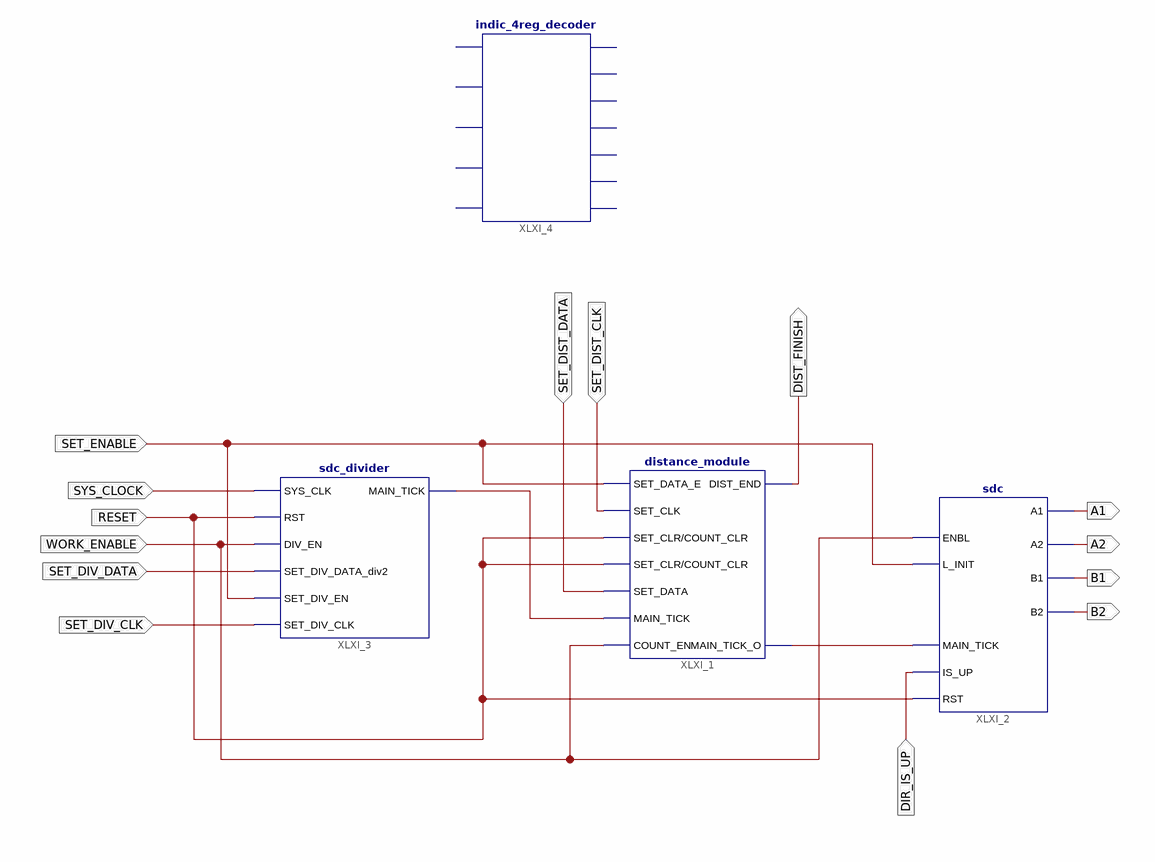
[diagram p0: schematic sheet 1]
// Xilinx ISE schematic topboard.sch (spartan6) as structural Verilog: 4 symbols, 14 ports
module topboard (
  input  RESET,
  input  WORK_ENABLE,
  input  SET_ENABLE,
  input  SET_DIV_DATA,
  input  SET_DIV_CLK,
  input  SYS_CLOCK,
  input  SET_DIST_CLK,
  input  SET_DIST_DATA,
  input  DIR_IS_UP,
  output A1,
  output A2,
  output B1,
  output B2,
  output DIST_FINISH
);

  wire XLXN_1, XLXN_2;

  sdc XLXI_2 (
    .ENBL(WORK_ENABLE), .L_INIT(SET_ENABLE), .A1(A1), .A2(A2), .B1(B1), .B2(B2), .MAIN_TICK(XLXN_1),
    .IS_UP(DIR_IS_UP), .RST(RESET));
  distance_module XLXI_1 (
    .SET_DATA_E(SET_ENABLE), .SET_CLK(SET_DIST_CLK), .SET_CLR(RESET), .COUNT_CLR(RESET),
    .SET_DATA(SET_DIST_DATA), .MAIN_TICK(XLXN_2), .COUNT_EN(WORK_ENABLE), .DIST_END(DIST_FINISH),
    .MAIN_TICK_O(XLXN_1));
  sdc_divider XLXI_3 (
    .SYS_CLK(SYS_CLOCK), .RST(RESET), .DIV_EN(WORK_ENABLE), .SET_DIV_DATA_div2(SET_DIV_DATA),
    .SET_DIV_EN(SET_ENABLE), .SET_DIV_CLK(SET_DIV_CLK), .MAIN_TICK(XLXN_2));
  indic_4reg_decoder XLXI_4 ();  // open: DIRECTION, COUNT, RESET, COUNT_EN, SEG_SWITCH, SEG_A, SEG_B, SEG_C, SEG_D, SEG_E, SEG_F, SEG_G
endmodule
